# Altium project Project.PrjPcb
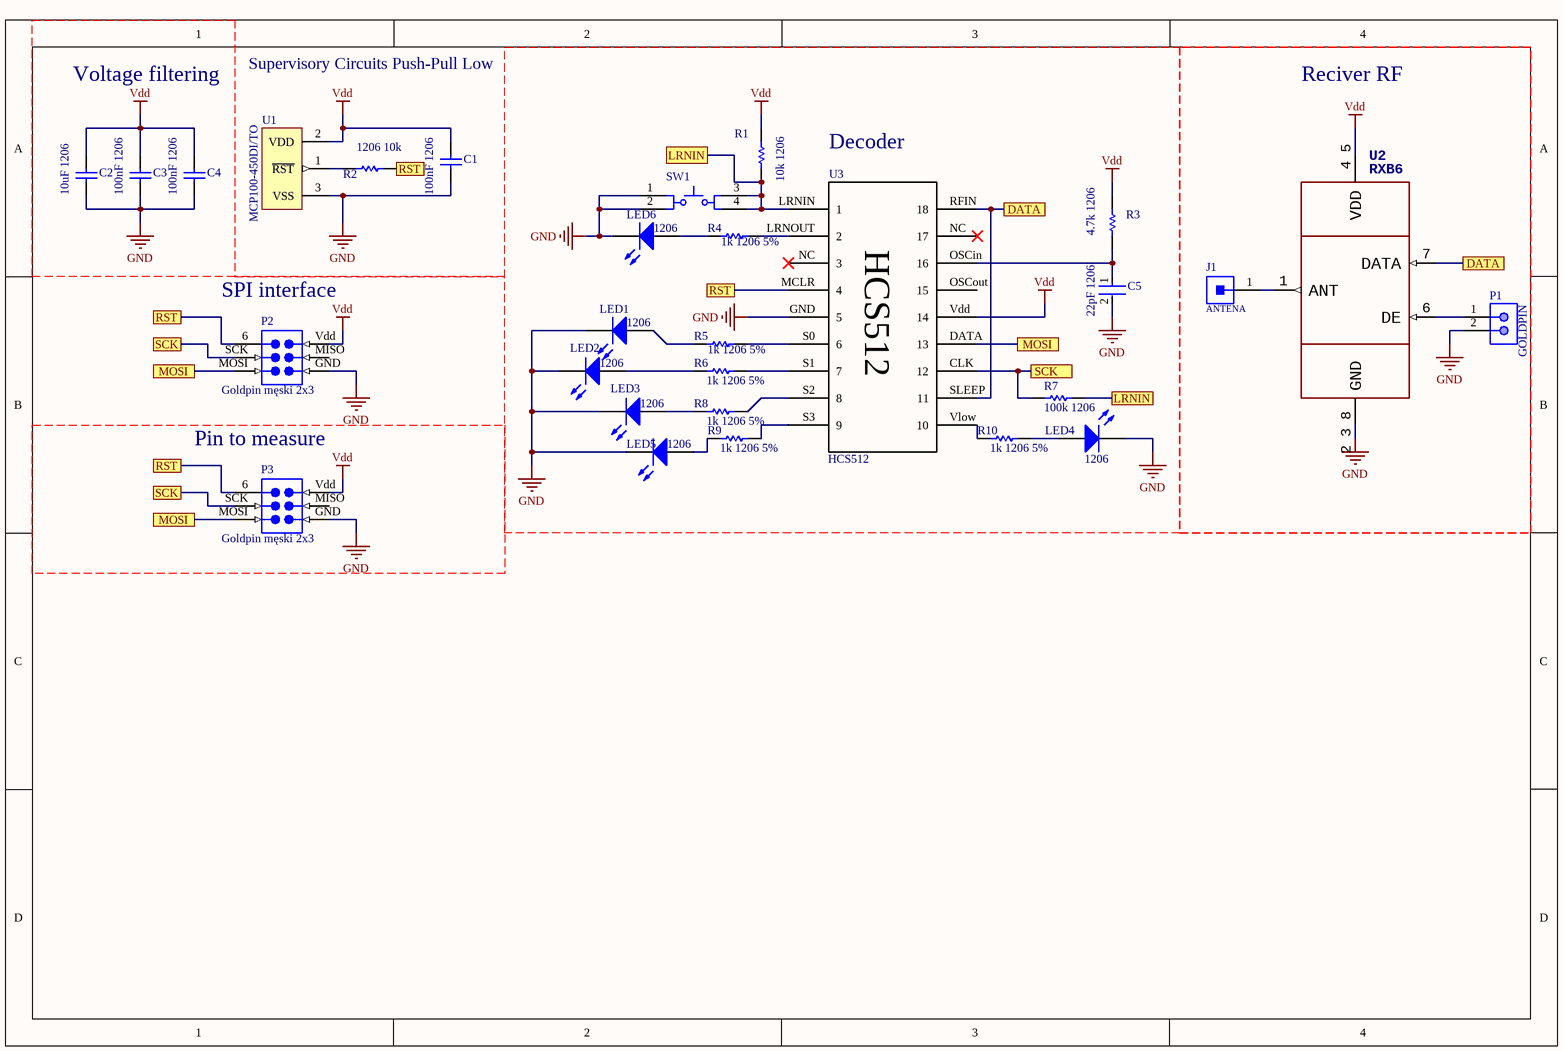
[diagram p0: schema.SchDoc]
1 sheet, 29 parts. Net scope: flat (ports and power ports of the same name join across sheets).

## Sheet schema.SchDoc
size A4

### Parts
C1  100nF 1206  [KEMT-1206-2_M]
C2  10uF 1206  [CAPC3216X180X50ML20T25]
C3  100nF 1206  [KEMT-1206-2_M]
C4  100nF 1206  [KEMT-1206-2_M]
C5  22pF 1206  [FP-C1206C-EB-MFG]
J1  ANTENA  [61300111121]
LED1  1206  [1206_A]
LED2  1206  [1206_A]
LED3  1206  [1206_A]
LED4  1206  [1206_A]
LED5  1206  [1206_A]
LED6  1206  [1206_A]
P1  GOLDPIN  [AMPH-68000-102HLF_V]
P2  Goldpin męski 2x3  [SMTC-TSW-103-08-X-D]
P3  Goldpin męski 2x3  [SMTC-TSW-103-08-X-D]
R1  10k 1206  [RESC3216X60X45ML10T20]
R2  1206 10k  [RESC3216X60X45ML10T20]
R3  4.7k 1206  [RESC3216X60X45ML15T20]
R4  1k 1206 5%  [RESC3216X70X50LL05T20]
R5  1k 1206 5%  [RESC3216X70X50LL05T20]
R6  1k 1206 5%  [RESC3216X70X50LL05T20]
R7  100k 1206  [RESC3216X70X50LL05T20]
R8  1k 1206 5%  [RESC3216X70X50LL05T20]
R9  1k 1206 5%  [RESC3216X70X50LL05T20]
R10  1k 1206 5%  [RESC3216X70X50LL05T20]
SW1  TL3301NF160QG  [ESWI-TL3301NF160QG_V]  (value not drawn)
U1  MCP100-450DI/TO  [TO-92-TO3]
U2  RXB6  [JMR-TX1]
U3  HCS512  [*DIP794W47P254L2324H457Q18]

### Ports
DATA, LRNIN, MOSI, RST, SCK

### Nets
GND: C1.1 C2.1 C3.1 C4.1 C5.2 LED1.1(K) LED2.1(K) LED3.1(K) LED4.1(K) LED5.1(K) LED6.1(K) P1.2 P2.GND P3.GND SW1.1 SW1.2 U1.3(VSS) U2.2_3_8(GND) U3.GND(5)
Vdd: C1.2 C2.2 C3.2 C4.2 P2.Vdd P3.Vdd R1.1 R3.2 U1.2(VDD) U2.4_5(VDD) U3.Vdd(14)
NetC5_1: C5.1 R3.1 U3.OSCin(16)
NetJ1_1: J1.1 U2.1(ANT)
NetLED1_2: LED1.2(A) R5.1
NetLED2_2: LED2.2(A) R6.1
NetLED3_2: LED3.2(A) R8.1
NetLED4_2: LED4.2(A) R10.2
NetLED5_2: LED5.2(A) R9.1
NetLED6_2: LED6.2(A) R4.1
NetP1_1: P1.1 U2.6(DE)
NetP2_6: P2.6 P3.6 R2.2 U3.MCLR(4) ; port RST
NetP2_MOSI: P2.MOSI P3.MOSI U3.DATA(13) ; port MOSI
NetP2_SCK: P2.SCK P3.SCK R7.1 U3.CLK(12) ; port SCK
NetR1_2: R1.2 R7.2 SW1.3 SW1.4 U3.LRNIN(1) ; port LRNIN
NetR2_1: R2.1 U1.1(~{RST})
NetR4_2: R4.2 U3.LRNOUT(2)
NetR5_2: R5.2 U3.S0(6)
NetR6_2: R6.2 U3.S1(7)
NetR8_2: R8.2 U3.S2(8)
NetR9_2: R9.2 U3.S3(9)
NetR10_1: R10.1 U3.Vlow(10)
NetU2_7: U2.7(DATA) U3.RFIN(18) U3.SLEEP(11) ; port DATA

Not connected (* = marked no-connect by the designer): P2 MISO; P3 MISO; U3 NC(17)* OSCout(15)

### Notes on the sheet
- Voltage filtering
- Supervisory Circuits Push-Pull Low
- Reciver RF
- Decoder
- (near P2) SPI interface
- Pin to measure

### Library data of the parts
C1 C3 C4 = CMP-2000-05169-1: CAP, Ceramic, 0.1 uF, +/- 10%, 50 V, -55 to 125 degC, 1206 (3216 Metric), RoHS, Tape and Reel; Manufacturer: Kemet; Voltage Rating: 50V; Capacitance: 0.1µF; Product Range: KEMET-CSeries; SVHC: ToBeAdvised; Dielectric Characteristic: X7R; Capacitor Case Style: 1206[3216Metric]; Package Reference: 1206-2; Package Description: 2-Leads SMD, Body 3.2 x 1.6 mm; Packaging: Tape&Reel; Operating Temperature Max: 125degC; Capacitance Tolerance: ±10%; Datasheet URL: https://datasheet.ciiva.com/6125/1725438-6125494.pdf; Manufacturer URL: http://www.kemet.com/; Operating Temperature Min: -55degC; Datasheet Version: Jul-13
C2 = CMP-1661-00005-1: Multilayer Ceramic Capacitor, 10 uF, +/- 10%, 16 V, 1206 (3216 Metric), -55 to 125 degC, RoHS, Tape and Reel; Case\Package: 0603; Tolerance: 1%; Power Rating: 100 mW; Resistance: 330 Ohm; Voltage Rating: 75 V; Width: 0.8 mm; REACH SVHC: Yes; Case Code (Metric): 1608; Pins: 2; ComponentLink2URL: http://datasheets.avx.com/X7RDielectric.pdf; Height: 0.45 mm; Max Operating Temperature: 155 degC; ComponentLink1Description: Manufacturer URL; ComponentLink1URL: http://www.avx.com/; ComponentLink2Description: Datasheet; PackageReference: 1206; Weight: 7.1E-05 oz; Min Operating Temperature: -55 degC; Case Code (Imperial): 0603; DatasheetVersion: Jul-16; RoHSCompliant: true; Packaging: Tape and Reel; Length: 1.6 mm; PackageDescription: 2-Pin Surface Mount Device, Body 3.2 x 1.6 mm; Package Quantity: 5000; Radiation Hardening: No; Mount: Surface Mount
C5 = CMP-03020-001476-1: 1206 22pF Ceramic Multilayer Capacitor; 50VDC; 125degC; C0G Dielec; +/-5% SMD; Manufacturer Part Number: C1206C220J5GACTU; Manufacturer: KEMET; Automotive Grade: Grade 0; Temperature Coefficient: 15%; Tolerance: 0.05; Voltage Rating: 50 V; Height: 0.88mm; Mouser Description: 1206 22pF Ceramic Multilayer Capacitor; 50VDC; 125degC; C0G Dielec; +/-5% SMD; Ipc Land Pattern Name: CAPC320160X78; Temperature Range High: +150°C; Automotive: Yes; Device Class L3: Ceramic Capacitors; ComponentLink2Description: Datasheet; Temperature: -55°C to +150°C; Lead Free: Yes; Category: Cap; Device Class L2: Capacitors; Device Class L1: Passive Components; Value: 22 pF; Capacitance: 22 pF; Digikey Description: 1206 22pF Ceramic Multilayer Capacitor; 50VDC; 125degC; C0G Dielec; +/-5% SMD; Octopart: https://octopart.com/c1206c220j5gactu-kemet-131912; Material: Ceramic; Temperature Characteristic: C0G; Package: C1206C-EB; RoHS: TRUE; ComponentLink2URL: https://content.kemet.com/datasheets/KEM_C1007_X8R_ULTRA_150C_SMD.pdf; Temperature Range Low: -55°C
J1 = CMP-1502-01058-1: THT Vertical Pin Header WR-PHD, Pitch 2.54 mm, Single Row, 1 pins; Manufacturer: Wurth Elektronik; Gender: Male; Working Voltage: 250VAC; Withstanding Voltage: 500VAC; Pin Number: 1; Contact Resistance: 20mOhm; Rated Current: 3A; Pitch: 2.54mm; Mounting Technology: THT; Datasheet URL: https://katalog.we-online.de/em/datasheet/6130xx11121.pdf; Manufacturer URL: http://www.we-online.de; Operating Temperature: -40to105degC; Publisher: WurthElektronik; Part Number: 61300111121; Row Number: Single; Package Reference: 61300111121; Orientation: Vertical; Packaging: Bag
LED1-LED6 = CMP-1426-00015-1: SMD mono-color Chip LED, WL-SMCW, Blue; Manufacturer: Wuerth Elektronik; PartNumber: 150120BS75000; ComponentLink2Description: Datasheet; ComponentLink1URL: http://www.we-online.com; ComponentLink1Description: Manufacturer URL; ComponentLink2URL: http://katalog.we-online.com/led/datasheet/150120BS75000.pdf; PackageReference: 1206_A; Color: Blue
P1 = CMP-2000-05666-1: Male Header, Pitch 2.54 mm, 1 x 2 Position, Height 8.38 mm, Tail Length 2.41 mm, RoHS, Bulk; Number of Positions: 2; Insulation Resistance: 5000MOhms; Voltage Rating: 1.5kV; Mounting Angle: Vertical; Pitch: 2.54mm; Brand: FCI; Current Rating: 3A; Mating Post Length: 5.84mm; Operating Temperature Range: -65Cto+125C; Product Category: Headers&WireHousings; Datasheet URL: https://datasheet.ciiva.com/5149/68000-274228-5149165.pdf; Number of Positions / Contacts: 2; Contact Gender: Pin(Male); Packaging: Bulk; Mounting Technology: ThroughHole; Product Type: Headers; Housing Material: Thermoplastic; Contact Material: PhosphorBronze; Contact Plating: Gold/GTX; Package Description: Male Header, Pitch 2.54 mm, 1 x 2 Position, Height 8.38 mm, Tail Length 2.41 mm; Package Reference: 68000-102HLF; Type: Unshrouded; Factory Pack Quantity: 100; Termination Style: ThroughHole; RoHS: Details; Series: 68000; Mounting Style: ThroughHole; Flammability Rating: UL94V-0; Number of Rows: 1; Manufacturer: FCI; Termination Post Length: 2.41mm; Manufacturer URL: http://www.amphenol.com/; Datasheet Version: Rev. F, 04/2006
P2 P3 = CMP-1024-00336-1: 0.025" SQ Post Header, Through-hole, Vertical, -55 to 125 degC, 2.54 mm Pitch, 6-Pin, Male, RoHS; Manufacturer: Samtec; PartNumber: TSW-103-08-L-D; Pitch: 2.54 mm; PackageVersion: DM, 8/1988; ComponentLink3Description: Package Specification; ComponentLink2Description: Datasheet; RoHS: True; ComponentLink1URL: http://www.samtec.com; PackageDescription: .025[0.64] SQ. Post Terminal Strip Assembly; PackageReference: TSW-103-08-X-D; Mounting Technology: Through-hole; DatasheetVersion: F-214; ComponentLink1Description: Manufacturer URL; Temperature Range: -55 to 125 degC; ComponentLink2URL: http://www.samtec.com/documents/webfiles/pdf/TSW_TH.PDF; ComponentLink3URL: http://www.samtec.com/documents/webfiles/cpdf/TSW-XXX-XX-XXX-X-XX-XXX-MKT.pdf; Orientation: Vertical
R1 R2 = CMP-2003-04808-1: Manufacturer: Vishay Dale; Part Number: CRCW120610K0JNEA
R3 = CMP-2100-03618-1: Chip Resistor, 4.7 KOhm, +/- 1%, 0.25 W, -55 to 155 degC, 1206 (3216 Metric), RoHS, Tape and Reel; Manufacturer: Vishay Semiconductor; Power Rating: 250mW; Voltage Rating: 200V; Temperature Coefficient: 100ppm/degreesC; Package Quantity: 10; Composition: ThickFilm; REACH SVHC: Unknown; Mount: SurfaceMount; Max Operating Temperature: 155degC; Length: 3.2mm; Number of Terminations: 2; Case Code (Metric): 3216; Military Standard: Not; Width: 1.6mm; Datasheet Version: 41061.0; Max Power Dissipation: 250mW; Datasheet URL: http://www.vishay.com/docs/20035/dcrcwe3.pdf; Contact Plating: Tin; Case/Package: 1206; Height: 0.55mm; Package Reference: 1206.0; Lead Free: LeadFree; Weight: 0.000353oz; Package Description: 2-Pin Surface Mount Device, Body 3.15 x 1.6 mm; Min Operating Temperature: -55degC; Resistance: 4.7KOhm; Packaging: TapeandReel; Depth: 1.6mm; Tolerance: 1%; RoHSCompliant: true; Termination: SMD/SMT; Case Code (Imperial): 1206; Voltage Rating (DC): 200V; Radiation Hardening: No; Manufacturer URL: http://www.vishay.com/
R4-R6 R8-R10 = CMP-2003-00544-1: Manufacturer: Panasonic; Part Number: ERJ-8GEYJ102V
R7 = CMP-2003-00019-1: Manufacturer: Panasonic; Part Number: ERJ-8ENF1003V
SW1 = CMP-2000-07250-1: Tactile Switch, SPST-NO, 12 V, -20 to 70 degC, 4-Pin SMD, RoHS, Tape and Reel; Manufacturer: E-Switch; Maximum DC Voltage Rating: 12V; Illumination Type: N/R; Contact Rating @ Voltage: 0.05@12VDCA; Operating Force: 1.57N; Pole Throw Configuration: SPST; Electrical Life: 100000Cycles; Body Orientation: Straight; Minimum Insulation Resistance: 100MOhm; Switch Configuration: N.O.; Dielectric Strength: 250VAC; Actuator Style: RoundButton; Actuator Length: 0.7mm; Ground Terminal: No; Package Reference: TL3301NF160QG; Mounting Technology: SurfaceMount; Type: N/A; Datasheet URL: http://spec_sheets.e-switch.com/specs/P010515.pdf; Seal Description: N/A; Contact Plating: Silver; Dimension: 6x10x4.3mm; Family: TL; Packaging: TapeandReel; Contact Material: PhosphorBronze; Maximum AC Voltage Rating: N/A; Housing Material: PolyphenyleneSulfide,Nylon; Part No: TL3301NF160QG; RoHS: Yes; Package Description: 4-Pin Surface Mount Device, Body 6 x 6 mm; Datasheet Version: Rev. C, 12/2010; Base Material: N/A; Maximum Contact Resistance: 100mOhm; Mounting: SurfaceMount,GullWing; Operating Temperature: -20to70C; Mechanical Life: N/A; Manufacturer URL: http://www.e-switch.ch/en/; Actuator Color: N/A; Product Weight: N/A; Seal Location: N/A
U1 = CMP-0138-00082-1: Microcontroller Supervisory Circuit with Push-Pull Output, 3-Pin TO-92, Industrial Temperature; PackageVersion: revBB, Aug-2009; DatasheetVersion: revF, 2001; PackageDescription: 3-Lead Plastic Transistor Outline (TO) [TO-92]; PackageReference: TO-92-TO3
U2 = HXB6-*: GateName_1: G$1; SymbolName_1: RXB6-XXX-V; LibraryName: JMR_RF_Lib; DeviceSetName: HXB6-*; Package: RXB6-XXX-V